# Altium schematic sheet Daughter_Cards.SchDoc
size A; SheetNumber: 1; SheetTotal: 11
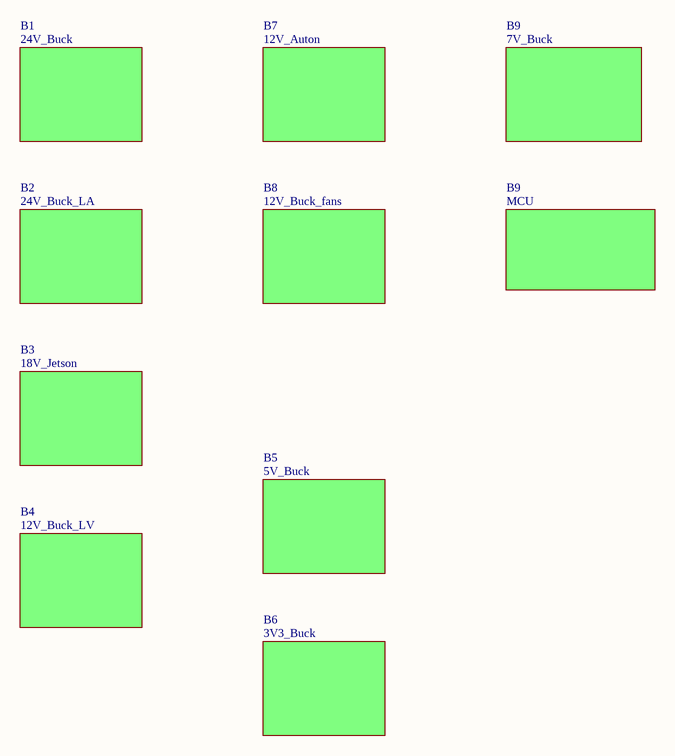
[diagram p0: Daughter_Cards.SchDoc]

## Sub-sheets
B1 = 24V_Buck: no entries
B2 = 24V_Buck_LA: no entries
B3 = 18V_Jetson: no entries
B4 = 12V_Buck_LV: no entries
B5 = 5V_Buck: no entries
B6 = 3V3_Buck: no entries
B7 = 12V_Auton: no entries
B8 = 12V_Buck_fans: no entries
B9 = 7V_Buck: no entries
B9 = MCU: no entries